# Altium schematic sheet Current_sensor.SchDoc
size A; SheetNumber: 3; SheetTotal: 6; SPICEModelCacheOXJWTCKB: <root> / <DocumentId>OXJWTCKB</DocumentId> / <CacheFrame Number="0"> / <Model Name="cap" Kind="MDL"> / <Text>*Default semiconductor capacitor / .MODEL CAP C()</Text> / </Model> / </CacheFrame> / </root>
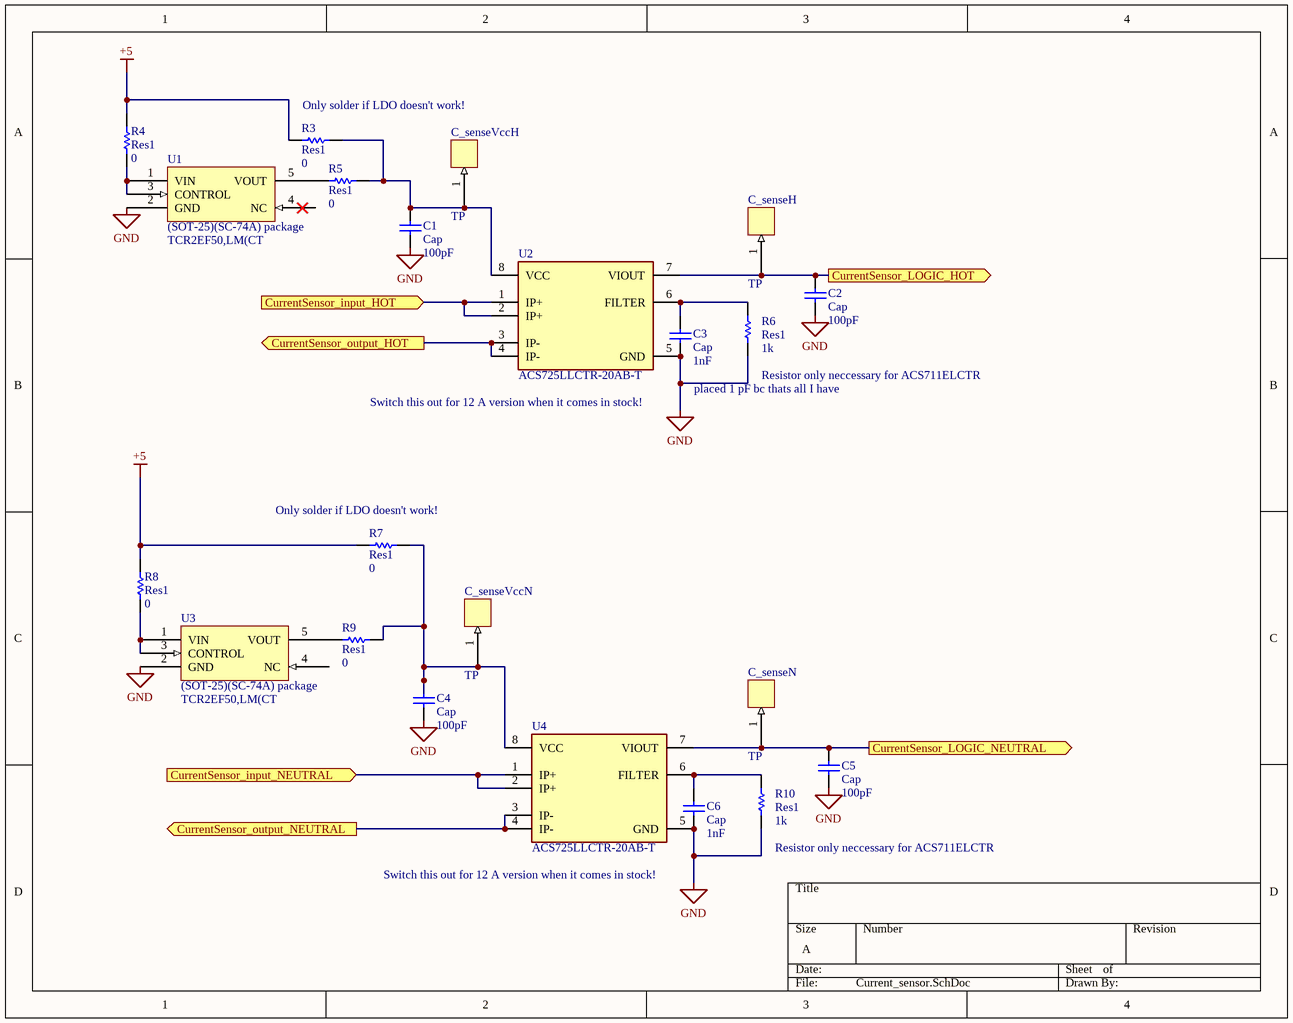
[diagram p0: Current_sensor.SchDoc]

## Parts
C1  Cap  value 100pF  [0603]
C2  Cap  value 100pF  [0603]
C3  Cap  value 1nF  [0603]
C4  Cap  value 100pF  [0603]
C5  Cap  value 100pF  [0603]
C6  Cap  value 1nF  [0603]
C_senseH  TP  [TP]
C_senseN  TP  [TP]
C_senseVccH  TP  [TP]
C_senseVccN  TP  [TP]
R3  Res1  value 0  [0603]
R4  Res1  value 0  [0603]
R5  Res1  value 0  [0603]
R6  Res1  value 1k  [0603]
R7  Res1  value 0  [0603]
R8  Res1  value 0  [0603]
R9  Res1  value 0  [0603]
R10  Res1  value 1k  [0603]
U1  TCR2EF50,LM(CT  [SOT95P275X130-5N]
U2  ACS725LLCTR-20AB-T  [FP-LCN-8-IPC_B]
U3  TCR2EF50,LM(CT  [SOT95P275X130-5N]
U4  ACS725LLCTR-20AB-T  [FP-LCN-8-IPC_B]

## Ports
CurrentSensor_input_HOT (in), CurrentSensor_input_NEUTRAL (in), CurrentSensor_LOGIC_HOT (out), CurrentSensor_LOGIC_NEUTRAL (out), CurrentSensor_output_HOT (out), CurrentSensor_output_NEUTRAL (out)

## Nets
+5: R3.2 R4.1 R7.2 R8.1
GND: C1.1 C2.1 C3.1 C4.1 C5.1 C6.1 R6.1 R10.1 U1.2(GND) U2.5(GND) U3.2(GND) U4.5(GND)
CurrentSensor_input_HOT: U2.1(IP+) U2.2(IP+) ; port CurrentSensor_input_HOT
CurrentSensor_input_NEUTRAL: U4.1(IP+) U4.2(IP+) ; port CurrentSensor_input_NEUTRAL
CurrentSensor_LOGIC_HOT: C2.2 C_senseH.1 U2.7(VIOUT) ; port CurrentSensor_LOGIC_HOT
CurrentSensor_LOGIC_NEUTRAL: C5.2 C_senseN.1 U4.7(VIOUT) ; port CurrentSensor_LOGIC_NEUTRAL
CurrentSensor_output_HOT: U2.3(IP-) U2.4(IP-) ; port CurrentSensor_output_HOT
CurrentSensor_output_NEUTRAL: U4.3(IP-) U4.4(IP-) ; port CurrentSensor_output_NEUTRAL
NetC1_2: C1.2 C_senseVccH.1 R3.1 R5.1 U2.8(VCC)
NetC3_2: C3.2 R6.2 U2.6(FILTER)
NetC4_2: C4.2 C_senseVccN.1 R7.1 R9.1 U4.8(VCC)
NetC6_2: C6.2 R10.2 U4.6(FILTER)
NetR4_2: R4.2 U1.1(VIN) U1.3(CONTROL)
NetR5_2: R5.2 U1.5(VOUT)
NetR8_2: R8.2 U3.1(VIN) U3.3(CONTROL)
NetR9_2: R9.2 U3.5(VOUT)

Not connected (* = marked no-connect by the designer): U1 4(NC); U3 4(NC)

## Notes on the sheet
- (near R3) Only solder if LDO doesn't work!
- Switch this out for 12 A version when it comes in stock!
- placed 1 pF bc thats all I have
- (near R6) Resistor only neccessary for ACS711ELCTR
- (near R7) Only solder if LDO doesn't work!
- (near R10) Resistor only neccessary for ACS711ELCTR
- (in symbol TCR2EF50,LM(CT) (SOT-25)(SC-74A) package

## Library data of the parts
C1-C6 = Cap: Capacitor; Published: 8-Jun-2000; LatestRevisionDate: 17-Jul-2002; LatestRevisionNote: Re-released for DXP Platform.; PackageReference: RAD-0.3; Publisher: Altium Limited; PackageDescription: Radial Cap, Thru-Hole; 2 Leads; 0.3 in Pin Spacing
R3-R10 = Res1: Resistor; Published: 8-Jun-2000; LatestRevisionDate: 17-Jul-2002; LatestRevisionNote: Re-released for DXP Platform.; PackageReference: AXIAL-0.3; Publisher: Altium Limited; PackageDescription: Axial Device, Thru-Hole; 2 Leads; 0.3 in Pin Spacing
U2 U4 = CMP-82923-000001-3: SENSOR CURRENT HALL 20A AC/DC; Accuracy: 0.8%; Linearity: 1.5%; Polarity: Bidirectional; Bandwidth: 120kHz; Number of Channels: 1; Sensitivity: 66mV/A; Quiescent Current: 10mA; Response Time: 4us; Max Supply Current: 14mA; Frequency: 120kHz; Min Operating Temperature: -40°C; Max Operating Temperature: 150°C; Case/Package: SOIC; Current Sensing: 20A; Packaging: Tape and Reel; Number of Pins: 8; Mount: Surface Mount; RoHS Compliant: Yes